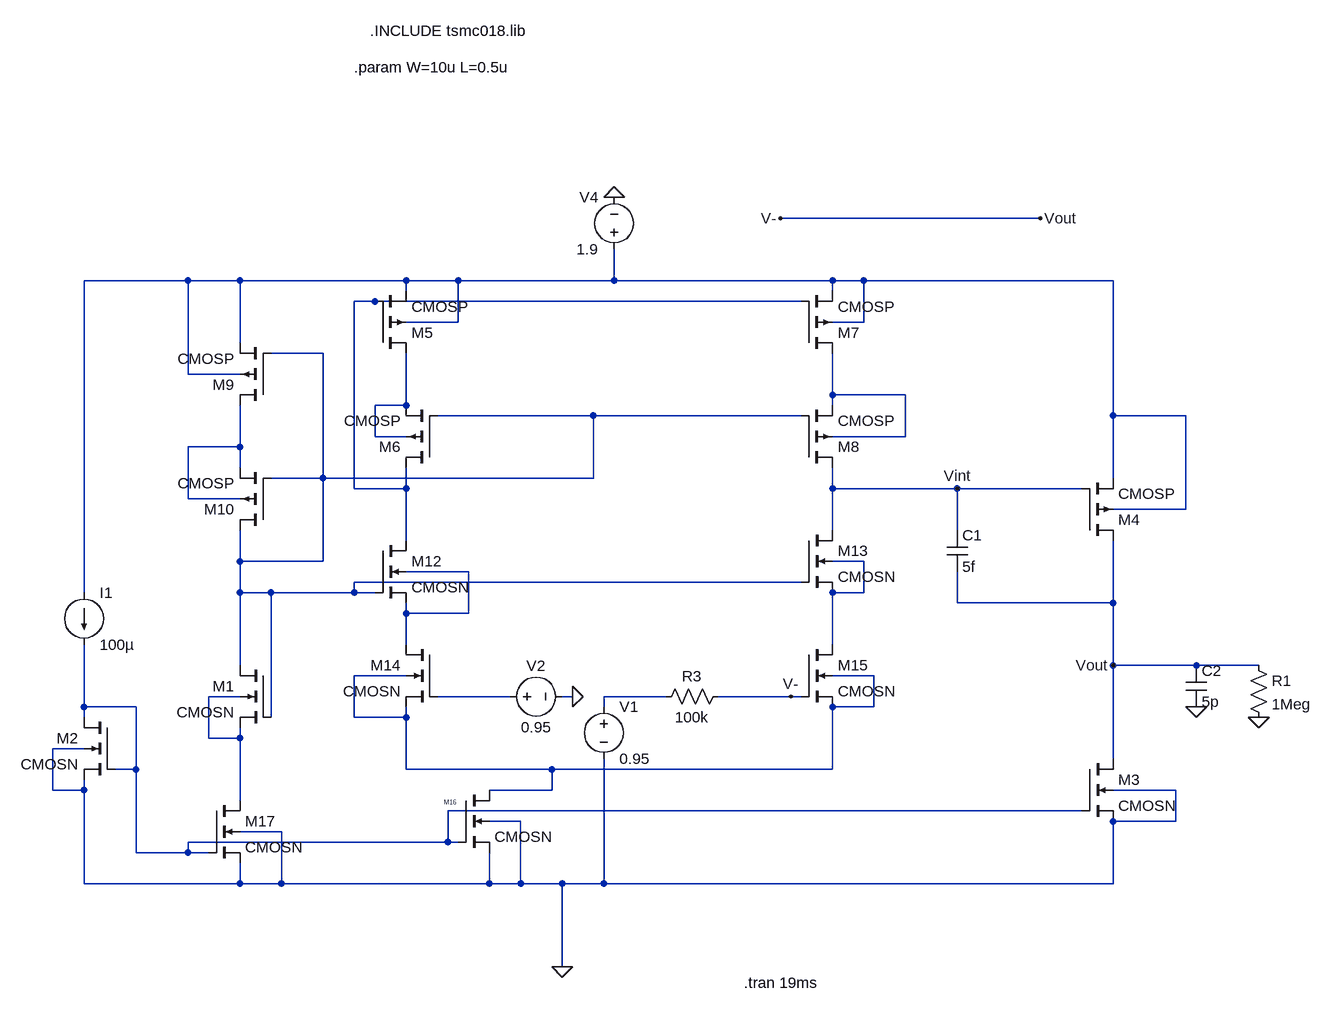
[diagram p0: schematic Draft2FInal.asc]
Draft2FInal.asc, the LTspice schematic file:
Version 4
SHEET 1 2980 888
WIRE 1360 -304 960 -304
WIRE 48 -208 -112 -208
WIRE 128 -208 48 -208
WIRE 384 -208 128 -208
WIRE 464 -208 384 -208
WIRE 704 -208 704 -256
WIRE 704 -208 464 -208
WIRE 1040 -208 704 -208
WIRE 1088 -208 1040 -208
WIRE 1472 -208 1088 -208
WIRE 384 -192 384 -208
WIRE 1040 -192 1040 -208
WIRE 336 -176 304 -176
WIRE 992 -176 336 -176
WIRE 464 -144 464 -208
WIRE 464 -144 384 -144
WIRE 1088 -144 1088 -208
WIRE 1088 -144 1040 -144
WIRE 128 -112 128 -208
WIRE 256 -96 176 -96
WIRE 48 -64 48 -208
WIRE 128 -64 48 -64
WIRE 1040 -32 1040 -96
WIRE 1152 -32 1040 -32
WIRE 384 -16 384 -96
WIRE 384 -16 336 -16
WIRE 1040 -16 1040 -32
WIRE 384 0 384 -16
WIRE 672 0 432 0
WIRE 992 0 672 0
WIRE 1472 0 1472 -208
WIRE 1584 0 1472 0
WIRE 336 32 336 -16
WIRE 384 32 336 32
WIRE 1152 32 1152 -32
WIRE 1152 32 1040 32
WIRE 128 48 128 -16
WIRE 128 48 48 48
WIRE 128 80 128 48
WIRE 256 96 256 -96
WIRE 256 96 176 96
WIRE 672 96 672 0
WIRE 672 96 256 96
WIRE 1472 96 1472 0
WIRE 304 112 304 -176
WIRE 384 112 384 80
WIRE 384 112 304 112
WIRE 1040 112 1040 80
WIRE 1232 112 1040 112
WIRE 1424 112 1232 112
WIRE 48 128 48 48
WIRE 128 128 48 128
WIRE 1584 144 1584 0
WIRE 1584 144 1472 144
WIRE 1040 176 1040 112
WIRE 1232 176 1232 112
WIRE 384 192 384 112
WIRE 128 224 128 176
WIRE 256 224 256 96
WIRE 256 224 128 224
WIRE 1088 224 1040 224
WIRE 480 240 384 240
WIRE 992 256 304 256
WIRE -112 272 -112 -208
WIRE 128 272 128 224
WIRE 176 272 128 272
WIRE 304 272 304 256
WIRE 304 272 176 272
WIRE 336 272 304 272
WIRE 1040 272 1040 256
WIRE 1088 272 1088 224
WIRE 1088 272 1040 272
WIRE 1232 288 1232 240
WIRE 1472 288 1472 192
WIRE 1472 288 1232 288
WIRE 384 304 384 288
WIRE 480 304 480 240
WIRE 480 304 384 304
WIRE 384 352 384 304
WIRE 1040 352 1040 272
WIRE 128 384 128 272
WIRE 1472 384 1472 288
WIRE 1600 384 1472 384
WIRE 1696 384 1600 384
WIRE 384 400 304 400
WIRE 1104 400 1040 400
WIRE 128 432 80 432
WIRE 544 432 432 432
WIRE 640 432 624 432
WIRE 784 432 688 432
WIRE 976 432 864 432
WIRE 992 432 976 432
WIRE -112 448 -112 352
WIRE -32 448 -112 448
WIRE 688 448 688 432
WIRE 1040 448 1040 432
WIRE 1104 448 1104 400
WIRE 1104 448 1040 448
WIRE -112 464 -112 448
WIRE 176 464 176 272
WIRE 304 464 304 400
WIRE 384 464 384 448
WIRE 384 464 304 464
WIRE 80 496 80 432
WIRE 128 496 128 480
WIRE 128 496 80 496
WIRE -112 512 -160 512
WIRE 1472 528 1472 384
WIRE -32 544 -32 448
WIRE -32 544 -64 544
WIRE 384 544 384 464
WIRE 608 544 384 544
WIRE 1040 544 1040 448
WIRE 1040 544 608 544
WIRE -160 576 -160 512
WIRE -112 576 -112 560
WIRE -112 576 -160 576
WIRE 608 576 608 544
WIRE 608 576 512 576
WIRE 1568 576 1472 576
WIRE 128 592 128 496
WIRE 1424 608 448 608
WIRE 560 624 512 624
WIRE 1472 624 1472 608
WIRE 1568 624 1568 576
WIRE 1568 624 1472 624
WIRE 192 640 128 640
WIRE 448 656 448 608
WIRE 448 656 48 656
WIRE 464 656 448 656
WIRE -32 672 -32 544
WIRE 48 672 48 656
WIRE 48 672 -32 672
WIRE 80 672 48 672
WIRE -112 720 -112 576
WIRE 128 720 128 688
WIRE 128 720 -112 720
WIRE 192 720 192 640
WIRE 192 720 128 720
WIRE 512 720 512 672
WIRE 512 720 192 720
WIRE 560 720 560 624
WIRE 560 720 512 720
WIRE 624 720 560 720
WIRE 688 720 688 528
WIRE 688 720 624 720
WIRE 1472 720 1472 624
WIRE 1472 720 688 720
WIRE 624 848 624 720
FLAG 624 848 0
FLAG 1472 384 Vout
FLAG 1600 448 0
FLAG 1696 464 0
FLAG 1232 112 Vint
FLAG 704 -336 0
FLAG 960 -304 V-
FLAG 1360 -304 Vout
FLAG 976 432 V-
FLAG 640 432 0
SYMBOL current -112 272 R0
SYMATTR InstName I1
SYMATTR Value 100µ
SYMBOL cmosn -64 464 M0
SYMATTR InstName M2
SYMATTR Value2 l=L w=40u
SYMBOL cmosn 80 592 R0
SYMATTR InstName M17
SYMATTR Value2 l=L w=W
SYMBOL cmosn 176 384 M0
SYMATTR InstName M1
SYMATTR Value2 l=L w=12u
SYMBOL cmosp 176 176 R180
SYMATTR InstName M10
SYMATTR Value2 l=L w=W
SYMBOL cmosp 176 -16 R180
SYMATTR InstName M9
SYMATTR Value2 l=L w=W
SYMBOL cmosn 464 576 R0
WINDOW 0 -22 19 Left 0
SYMATTR InstName M16
SYMATTR Value2 l=L w=5u
SYMBOL voltage 528 432 M90
WINDOW 0 -32 56 VBottom 2
WINDOW 3 32 56 VTop 2
SYMATTR InstName V2
SYMATTR Value 0.95
SYMATTR SpiceLine Rser=0
SYMBOL cmosn 432 352 M0
SYMATTR InstName M14
SYMATTR Value2 l=L w=15u
SYMBOL cmosn 336 192 R0
SYMATTR InstName M12
SYMATTR Value2 l=L w=30u
SYMBOL cmosn 992 352 R0
SYMATTR InstName M15
SYMATTR Value2 l=L w=15u
SYMBOL cmosn 992 176 R0
SYMATTR InstName M13
SYMATTR Value2 l=L w=30u
SYMBOL cmosp 432 80 R180
SYMATTR InstName M6
SYMATTR Value2 l=L w=17u
SYMBOL cmosp 336 -96 M180
SYMATTR InstName M5
SYMATTR Value2 l=L w=5u
SYMBOL cmosp 992 80 M180
SYMATTR InstName M8
SYMATTR Value2 l=L w=17u
SYMBOL cmosp 992 -96 M180
SYMATTR InstName M7
SYMATTR Value2 l=L w=5u
SYMBOL cmosp 1424 192 M180
SYMATTR InstName M4
SYMATTR Value2 l=0.5u w=20.4u
SYMBOL cap 1216 176 R0
SYMATTR InstName C1
SYMATTR Value 5f
SYMBOL cmosn 1424 528 R0
SYMATTR InstName M3
SYMATTR Value2 l=L w=W
SYMBOL cap 1584 384 R0
SYMATTR InstName C2
SYMATTR Value 5p
SYMBOL res 1680 368 R0
SYMATTR InstName R1
SYMATTR Value 1Meg
SYMBOL voltage 688 432 R0
SYMATTR InstName V1
SYMATTR Value 0.95
SYMBOL voltage 704 -240 R180
WINDOW 0 24 96 Left 2
WINDOW 3 24 16 Left 2
SYMATTR InstName V4
SYMATTR Value 1.9
SYMBOL res 880 416 R90
WINDOW 0 0 56 VBottom 2
WINDOW 3 32 56 VTop 2
SYMATTR InstName R3
SYMATTR Value 100k
TEXT 328 -592 Left 2 !.INCLUDE tsmc018.lib
TEXT 304 -536 Left 2 !.param W=10u L=0.5u
TEXT 904 872 Left 2 !.tran 19ms
LINE Normal 340 720 344 720 2

The netlist it stands for:
* Draft2FInal.asc
I1 N001 N013 100µ
M2 N013 N013 0 0 CMOSN l=L w=40u
M17 N010 N013 0 0 CMOSN l=L w=W
M1 N003 N003 N010 N010 CMOSN l=L w=12u
M10 N003 N003 N006 N006 CMOSP l=L w=W
M9 N006 N003 N001 N001 CMOSP l=L w=W
M16 N009 N013 0 0 CMOSN l=L w=5u
V2 N011 0 0.95 Rser=0
M14 N008 N011 N009 N009 CMOSN l=L w=15u
M12 N002 N003 N008 N008 CMOSN l=L w=30u
M15 N007 V- N009 N009 CMOSN l=L w=15u
M13 Vint N003 N007 N007 CMOSN l=L w=30u
M6 N002 N003 N005 N005 CMOSP l=L w=17u
M5 N005 N002 N001 N001 CMOSP l=L w=5u
M8 Vint N003 N004 N004 CMOSP l=L w=17u
M7 N004 N002 N001 N001 CMOSP l=L w=5u
M4 V- Vint N001 N001 CMOSP l=0.5u w=20.4u
C1 Vint V- 5f
M3 V- N013 0 0 CMOSN l=L w=W
C2 V- 0 5p
R1 V- 0 1Meg
V1 N012 0 0.95
V4 N001 0 1.9
R3 V- N012 100k
.model NMOS NMOS
.model PMOS PMOS
.lib standard.mos
.INCLUDE tsmc018.lib
.param W=10u L=0.5u
.tran 19ms
.backanno
.end